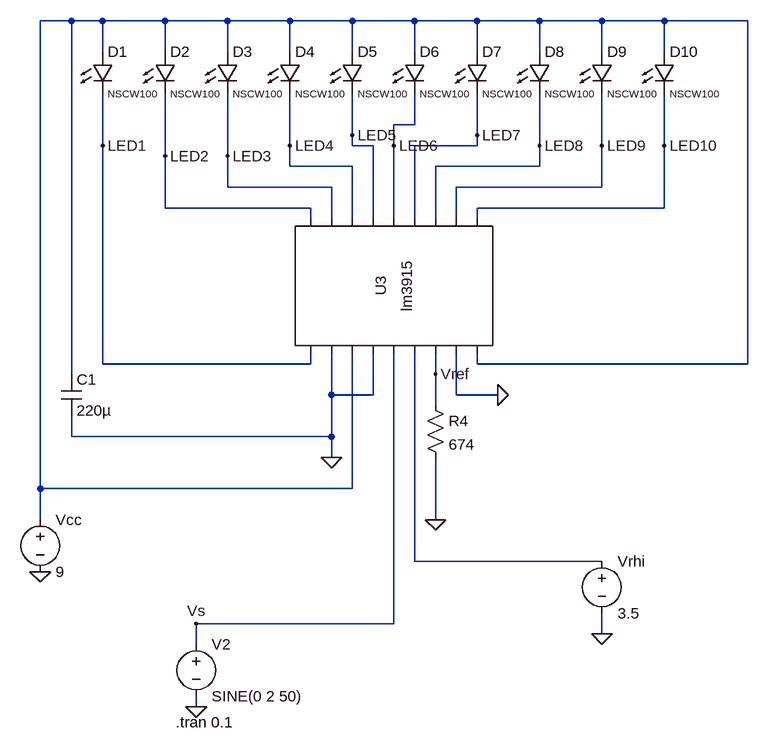
[diagram p0: schematic LM3915_Base_Circuit.asc]
LM3915_Base_Circuit.asc, the LTspice schematic file:
Version 4
SHEET 1 1420 680
WIRE -192 -832 -240 -832
WIRE -144 -832 -192 -832
WIRE -48 -832 -144 -832
WIRE 48 -832 -48 -832
WIRE 144 -832 48 -832
WIRE 240 -832 144 -832
WIRE 336 -832 240 -832
WIRE 432 -832 336 -832
WIRE 528 -832 432 -832
WIRE 624 -832 528 -832
WIRE 720 -832 624 -832
WIRE 848 -832 720 -832
WIRE -144 -784 -144 -832
WIRE -48 -784 -48 -832
WIRE 48 -784 48 -832
WIRE 144 -784 144 -832
WIRE 240 -784 240 -832
WIRE 336 -784 336 -832
WIRE 432 -784 432 -832
WIRE 528 -784 528 -832
WIRE 624 -784 624 -832
WIRE 720 -784 720 -832
WIRE 336 -672 336 -720
WIRE 336 -672 304 -672
WIRE 240 -656 240 -720
WIRE 432 -656 432 -720
WIRE -144 -640 -144 -720
WIRE 144 -640 144 -720
WIRE 240 -640 240 -656
WIRE 272 -640 240 -640
WIRE 304 -640 304 -672
WIRE 432 -640 432 -656
WIRE 432 -640 336 -640
WIRE 528 -640 528 -720
WIRE 624 -640 624 -720
WIRE 720 -640 720 -720
WIRE -48 -624 -48 -720
WIRE 48 -624 48 -720
WIRE 144 -608 144 -640
WIRE 240 -608 144 -608
WIRE 528 -608 528 -640
WIRE 528 -608 368 -608
WIRE 48 -576 48 -624
WIRE 208 -576 48 -576
WIRE 624 -576 624 -640
WIRE 624 -576 400 -576
WIRE -48 -544 -48 -624
WIRE 176 -544 -48 -544
WIRE 720 -544 720 -640
WIRE 720 -544 432 -544
WIRE 176 -528 176 -544
WIRE 208 -528 208 -576
WIRE 240 -528 240 -608
WIRE 272 -528 272 -640
WIRE 304 -528 304 -640
WIRE 336 -528 336 -640
WIRE 368 -528 368 -608
WIRE 400 -528 400 -576
WIRE 432 -528 432 -544
WIRE -144 -304 -144 -640
WIRE 176 -304 176 -320
WIRE 176 -304 -144 -304
WIRE 432 -304 432 -320
WIRE 848 -304 848 -832
WIRE 848 -304 432 -304
WIRE -192 -288 -192 -832
WIRE 368 -288 368 -320
WIRE 208 -256 208 -320
WIRE 272 -256 272 -320
WIRE 272 -256 208 -256
WIRE 400 -256 400 -320
WIRE 464 -256 400 -256
WIRE 368 -240 368 -288
WIRE -192 -192 -192 -224
WIRE 208 -192 208 -256
WIRE 208 -192 -192 -192
WIRE 208 -160 208 -192
WIRE -240 -112 -240 -832
WIRE 240 -112 240 -320
WIRE 240 -112 -240 -112
WIRE -240 -64 -240 -112
WIRE 368 -64 368 -160
WIRE 336 0 336 -320
WIRE 624 0 336 0
WIRE 304 96 304 -320
WIRE 304 96 0 96
WIRE 624 112 624 80
WIRE 0 128 0 96
WIRE 0 224 0 208
FLAG 208 -160 0
FLAG -240 16 0
FLAG 0 224 0
FLAG 0 96 Vs
FLAG 368 -64 0
FLAG -144 -640 LED1
FLAG -48 -624 LED2
FLAG 48 -624 LED3
FLAG 144 -640 LED4
FLAG 240 -656 LED5
FLAG 304 -640 LED6
FLAG 432 -656 LED7
FLAG 528 -640 LED8
FLAG 624 -640 LED9
FLAG 720 -640 LED10
FLAG 464 -256 0
FLAG 368 -288 Vref
FLAG 624 112 0
SYMBOL LED -160 -784 R0
WINDOW 3 24 64 Left 1
SYMATTR Value NSCW100
SYMATTR InstName D1
SYMBOL LED -64 -784 R0
WINDOW 3 24 64 Left 1
SYMATTR Value NSCW100
SYMATTR InstName D2
SYMBOL LED 32 -784 R0
WINDOW 3 24 64 Left 1
SYMATTR Value NSCW100
SYMATTR InstName D3
SYMBOL LED 128 -784 R0
WINDOW 3 24 64 Left 1
SYMATTR Value NSCW100
SYMATTR InstName D4
SYMBOL LED 224 -784 R0
WINDOW 3 24 64 Left 1
SYMATTR Value NSCW100
SYMATTR InstName D5
SYMBOL LED 320 -784 R0
WINDOW 3 24 64 Left 1
SYMATTR Value NSCW100
SYMATTR InstName D6
SYMBOL LED 416 -784 R0
WINDOW 3 24 64 Left 1
SYMATTR Value NSCW100
SYMATTR InstName D7
SYMBOL LED 512 -784 R0
WINDOW 3 24 64 Left 1
SYMATTR Value NSCW100
SYMATTR InstName D8
SYMBOL LED 608 -784 R0
WINDOW 3 24 64 Left 1
SYMATTR Value NSCW100
SYMATTR InstName D9
SYMBOL LED 704 -784 R0
WINDOW 3 24 64 Left 1
SYMATTR Value NSCW100
SYMATTR InstName D10
SYMBOL cap -208 -288 R0
SYMATTR InstName C1
SYMATTR Value 220µ
SYMBOL voltage -240 -80 R0
WINDOW 123 0 0 Left 0
WINDOW 39 0 0 Left 0
SYMATTR InstName Vcc
SYMATTR Value 9
SYMBOL voltage 0 112 R0
WINDOW 123 0 0 Left 0
WINDOW 39 0 0 Left 0
SYMATTR InstName V2
SYMATTR Value SINE(0 2 50)
SYMBOL AutoGenerated\\lm3915 304 -416 R270
SYMATTR InstName U3
SYMBOL res 352 -256 R0
SYMATTR InstName R4
SYMATTR Value 674
SYMBOL voltage 624 -16 R0
WINDOW 123 0 0 Left 0
WINDOW 39 0 0 Left 0
SYMATTR InstName Vrhi
SYMATTR Value 3.5
TEXT -32 248 Left 2 !.tran 0.1

The netlist it stands for:
* LM3915_Base_Circuit.asc
D1 N001 LED1 NSCW100
D2 N001 LED2 NSCW100
D3 N001 LED3 NSCW100
D4 N001 LED4 NSCW100
D5 N001 LED5 NSCW100
D6 N001 LED6 NSCW100
D7 N001 LED7 NSCW100
D8 N001 LED8 NSCW100
D9 N001 LED9 NSCW100
D10 N001 LED10 NSCW100
C1 N001 0 220µ
Vcc N001 0 9
V2 Vs 0 SINE(0 2 50)
* U3: lm3915 (symbol AutoGenerated\lm3915 not available, pins judged from their places): pin1=LED1 pin2=0 pin3=N001 pin4=0 pin5=Vs pin6=N002 pin7=Vref pin8=0 pin9=N001 pin10=LED2 pin11=LED3 pin12=LED4 pin13=LED5 pin14=LED6 pin15=LED7 pin16=LED8 pin17=LED9 pin18=LED10
R4 Vref 0 674
Vrhi N002 0 3.5
.model D D
.lib standard.dio
.tran 0.1
.backanno
.end